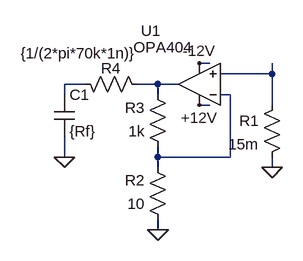
[diagram p0: schematic Draft5.asc]
Draft5.asc, the LTspice schematic file:
Version 4
SHEET 1 880 680
WIRE 256 -112 240 -112
WIRE 352 -96 352 -112
WIRE 352 -96 272 -96
WIRE 64 -80 32 -80
WIRE 176 -80 144 -80
WIRE 208 -80 176 -80
WIRE 32 -64 32 -80
WIRE 176 -64 176 -80
WIRE 288 -64 272 -64
WIRE 256 -48 240 -48
WIRE 352 -48 352 -96
WIRE 32 32 32 0
WIRE 176 32 176 16
WIRE 288 32 288 -64
WIRE 288 32 176 32
WIRE 176 48 176 32
WIRE 352 48 352 32
WIRE 176 144 176 128
FLAG 352 48 0
FLAG 240 -48 +12V
FLAG 240 -112 -12V
FLAG 32 32 0
FLAG 176 144 0
SYMBOL res 368 -64 M0
SYMATTR InstName R1
SYMATTR Value 15m
SYMBOL Opamps\\opamp2 240 -16 R180
WINDOW 0 59 146 Left 2
WINDOW 3 11 121 Left 2
SYMATTR InstName U1
SYMATTR Value OPA404
SYMBOL res 192 144 R180
WINDOW 0 36 76 Left 2
WINDOW 3 36 40 Left 2
SYMATTR InstName R2
SYMATTR Value 10
SYMBOL res 192 32 R180
WINDOW 0 36 76 Left 2
WINDOW 3 36 40 Left 2
SYMATTR InstName R3
SYMATTR Value 1k
SYMBOL res 160 -64 M270
WINDOW 0 25 56 VTop 2
WINDOW 3 79 106 VBottom 2
SYMATTR InstName R4
SYMATTR Value {1/(2*pi*70k*1n)}
SYMBOL cap 16 0 M180
WINDOW 0 24 64 Left 2
WINDOW 3 24 8 Left 2
SYMATTR InstName C1
SYMATTR Value {Rf}

The netlist it stands for:
* Draft5.asc
R1 N001 0 15m
XU1 N001 N004 +12V -12V N003 OPA404  ; pins In+ In- V+ V- OUT
R2 0 N004 10
R3 N004 N003 1k
R4 N003 N002 {1/(2*pi*70k*1n)}
C1 0 N002 {Rf}
.backanno
.end